# EAGLE design rzlblink_v2a (EAGLE 6.3)
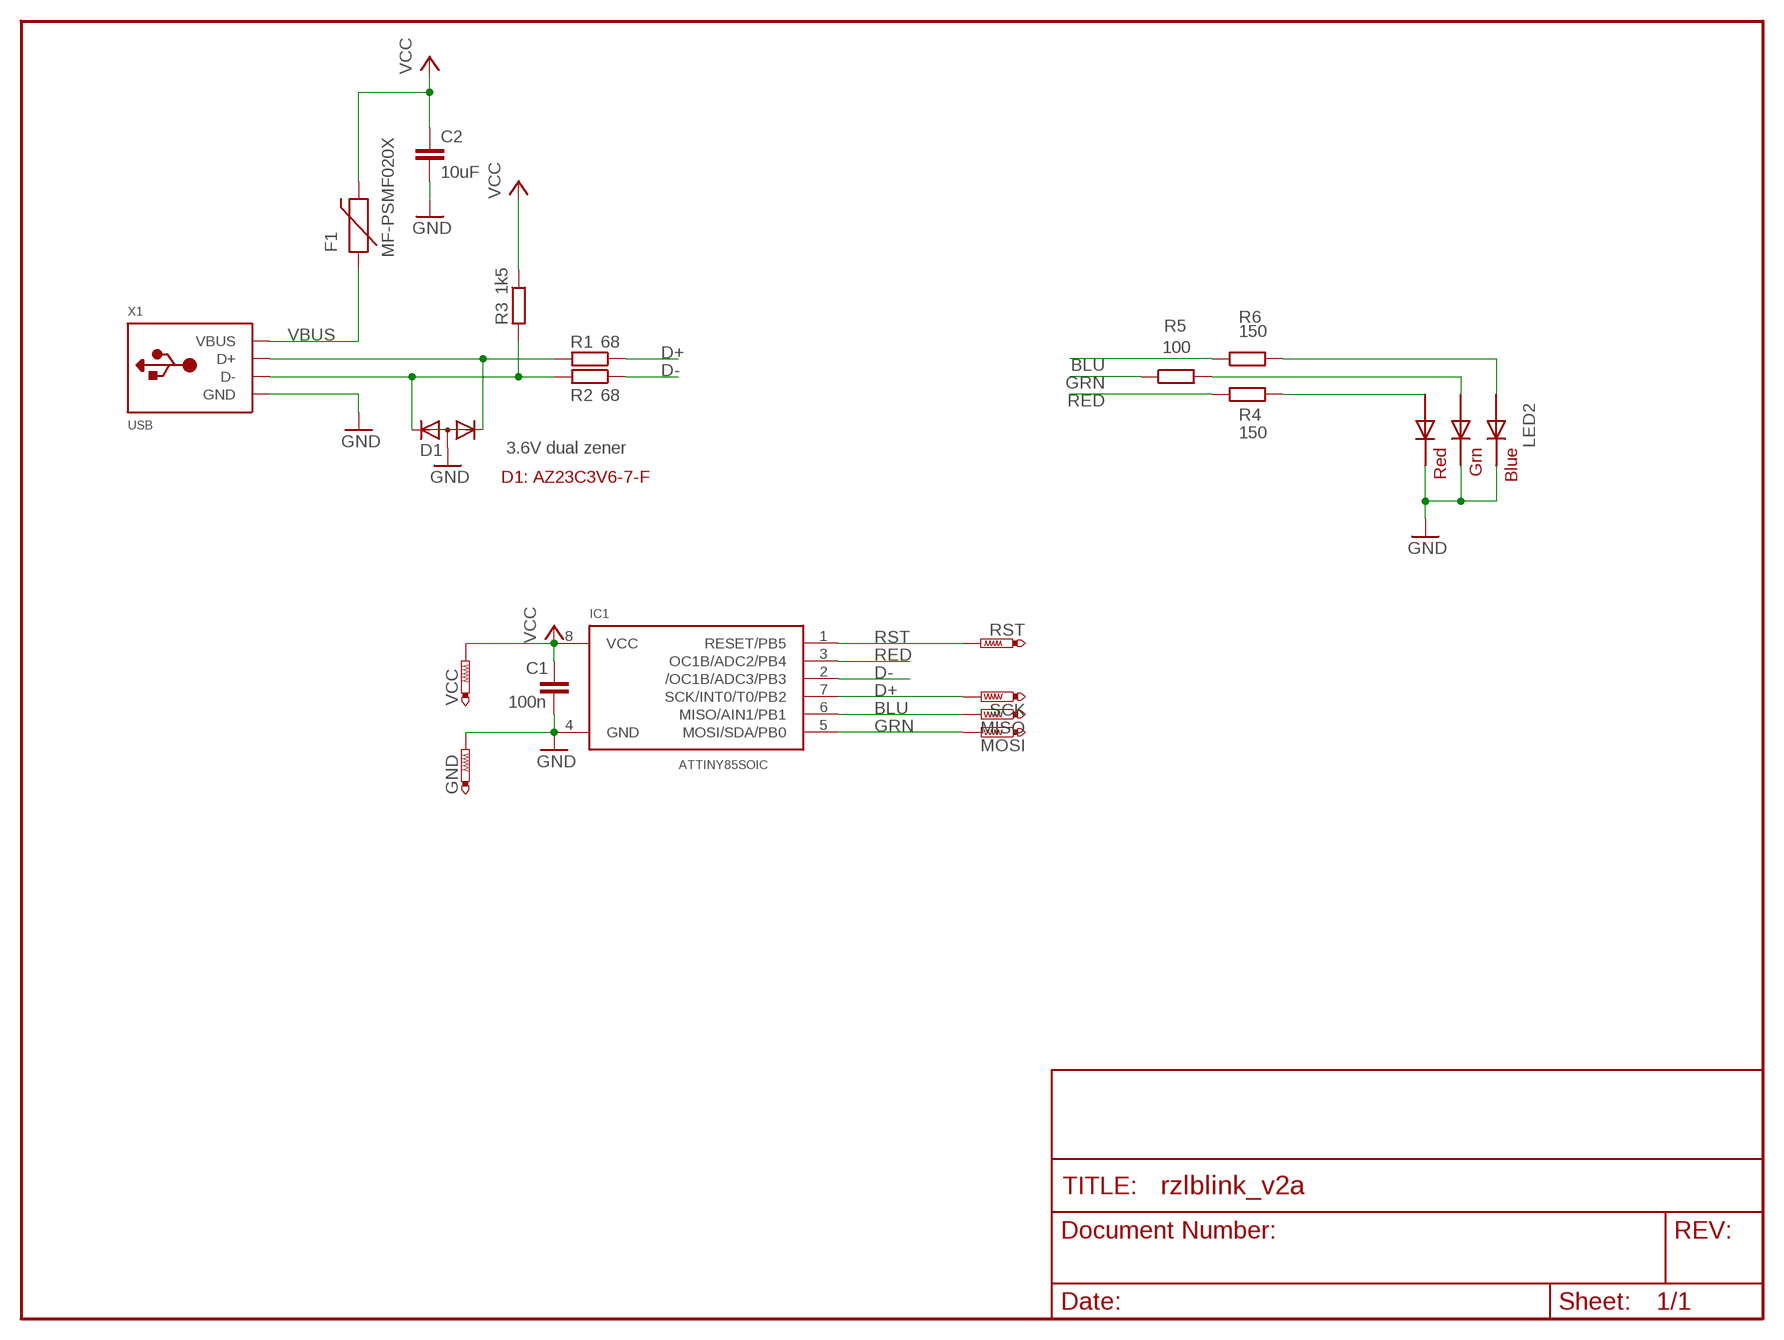
[diagram p0: schematic, sheet 1]

## Parts
C1  100n  C-EUC0805  [C0805]
C2  10uF  C-EUC0805  [C0805]
D1  3.6V dual zener  DIODE-2CA|ACSOT23  [SOT23]
F1  MF-PSMF020X  PTC0805  [0805]
GND  PTR1TP10R  [TP10R]
IC1  ATTINY85SOIC  ATTINY45SOIC  [SO08-EIAJ]
LED2  RGBLED5050  [RGBLED5050]
MISO  PTR1TP10R  [TP10R]
MOSI  PTR1TP10R  [TP10R]
R1  68  R-EU_R1206  [R1206]
R2  68  R-EU_R1206  [R1206]
R3  1k5  R-EU_R0805  [R0805]
R4  150  R-EU_R0805  [R0805]
R5  100  R-EU_R0805  [R0805]
R6  150  R-EU_R0805  [R0805]
RST  PTR1TP10R  [TP10R]
SCK  PTR1TP10R  [TP10R]
VCC  PTR1TP10R  [TP10R]
X1  USB  [MOLEX-48037-1000]

## Nets
BLU: IC1.6(MISO/AIN1/PB1) MISO.TP R6.1
D+: IC1.7(SCK/INT0/T0/PB2) R1.1 SCK.TP
D-: IC1.2(/OC1B/ADC3/PB3) R2.1
GND: C1.2 C2.2 D1.3(A) GND.TP IC1.4(GND) LED2.4(BLUE_C) LED2.5(RED_C) LED2.6(GREEN_C) X1.4(GND)
GRN: IC1.5(MOSI/SDA/PB0) MOSI.TP R5.1
N$4: D1.1(K1) R1.2 X1.3(D+)
N$5: D1.2(K2) R2.2 R3.2 X1.2(D-)
RBLU: LED2.3(BLUE_A) R6.2
RED: IC1.3(OC1B/ADC2/PB4) R4.1
RGRN: LED2.1(GREEN_A) R5.2
RRED: LED2.2(RED_A) R4.2
RST: IC1.1(RESET/PB5) RST.TP
VBUS: F1.1 X1.1(VBUS)
VCC: C1.1 C2.1 F1.2 IC1.8(VCC) R3.1 VCC.TP

## Notes on the sheet
- D1: AZ23C3V6-7-F

## Library data of the parts
C1 C2 = resistor:C-EU: CAPACITOR, European symbol
D1 = diode:DIODE-2CA|AC: Dual DIODE Cathode-Anode|Anode-Cathode
F1 = todstuff:PTC
GND MISO MOSI RST SCK VCC = testpad:PTR1: TEST PIN
IC1 = todstuff:ATTINY45
LED2 = adafruit:RGBLED: For 5050 RGB LEDs, the order of the LEDs may vary from one manufacturer to another!
R1-R6 = resistor:R-EU_: RESISTOR, European symbol
X1 = todstuff:USB

## Board
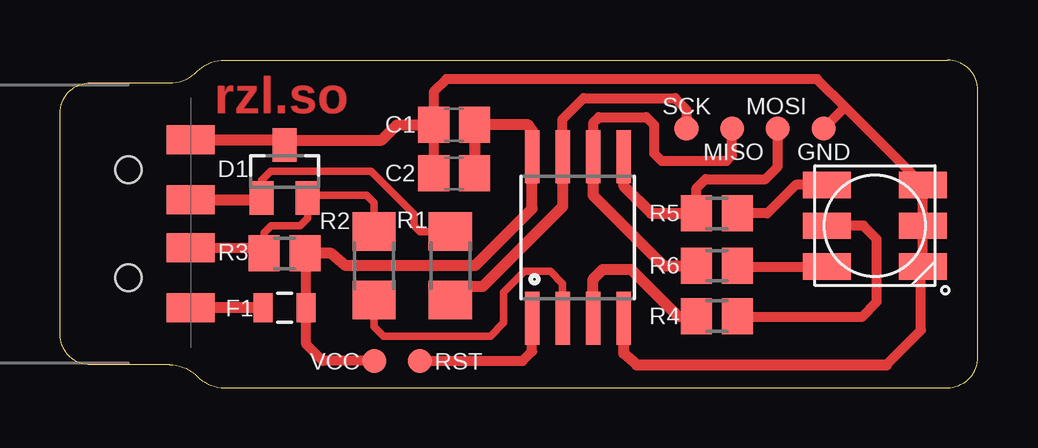
[diagram p1: board, top side]
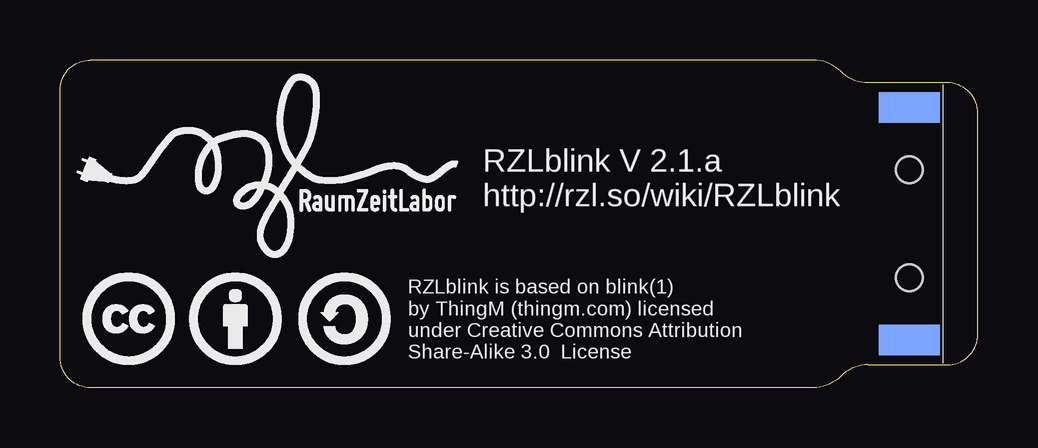
[diagram p2: board, bottom side, seen from below]

Size 38.26 x 13.65 mm. Coordinates in mm from the lower left corner, seen from the top.
Outline: 4.57,0.95 1.27,0.95 arc-90 0,2.22 0,11.43 arc-90 1.27,12.7 3.81,12.7 4.08,12.7 4.57,12.7 arc45 5.71,13.18 arc-45 6.86,13.65 36.99,13.65 arc-90 38.26,12.38 38.26,1.27 arc-90 36.99,0 6.86,0 arc-45 5.71,0.48 arc45 4.57,0.95
Copper layers (1*16): Top 0.035mm / dielectric 1.5mm / Bottom 0.035mm
Design rules "multi-cb_035um-cu *": minimum track width 6mil, minimum drill 12mil, track to track 10mil, track to pad 10mil, pad to pad 10mil, via to via 10mil, smd to smd 10mil, copper to edge 20mil, drill to drill 8mil, minimum pad ring 8mil, minimum via ring 6mil, stop-mask expansion 3mil, vias tented up to drill 0mil, thermal gap 8mil

### Footprints (pad centres in the part's own frame; a part is rotated, then mirrored left to right if it is on the bottom)
C0805 = smd 1.3 x 1.5: 1 -0.85,0; 2 0.85,0
SOT23 = smd 1 x 1.4: 1 -0.95,-1.1; 2 0.95,-1.1; 3 0,1.1
0805 = smd 0.8 x 1.2: 1 -0.9,0; 2 0.9,0
TP10R = smd 1 x 1: TP 0,0
SO08-EIAJ = smd 0.61 x 2.21: 1 -1.905,-3.378; 2 -0.635,-3.378; 3 0.635,-3.378; 4 1.905,-3.378; 5 1.905,3.353; 6 0.635,3.353; 7 -0.635,3.353; 8 -1.905,3.353
RGBLED5050 = smd 2 x 1.1: 1 -2,1.7; 2 -2,0; 3 -2,-1.7; 4 2,-1.7; 5 2,0; 6 2,1.7
R1206 = smd 1.6 x 1.803: 1 -1.422,0; 2 1.422,0
R0805 = smd 1.3 x 1.5: 1 -0.85,0; 2 0.85,0
MOLEX-48037-1000 = smd 2 x 1.2: 1 2.6,-3.5; 2 2.6,-1; 3 2.6,1; 4 2.6,3.5 | smd 2.54 x 1.27 bottom: P$1 0,4.85; P$2 0,-4.85 | hole 1.1: 0,2.25; 0,-2.25

### Placement (x,y rotation side)
C1  16.43,10.95 180 top
C2  16.43,8.93 180 top
D1  9.37,9.01 0 top
F1  9.37,3.33 0 top
GND  31.83,10.8 0 top
IC1  21.59,6.27 0 top
LED2  33.97,6.75 0 top
MISO  28.02,10.8 0 top
MOSI  29.92,10.8 0 top
R1  16.27,5.08 90 top
R2  13.1,5.08 90 top
R3  9.37,5.6 180 top
R4  27.38,2.98 0 top
R5  27.38,7.26 0 top
R6  27.38,5.08 0 top
RST  15,1.11 0 top
SCK  26.11,10.8 0 top
VCC  13.1,1.11 0 top
X1  2.86,6.83 0 top

### Tracks (layer width: path | path; a pad name or v marks a point on that pad's centre or on a via)
BLU
  Top 0.406: IC1.6 22.15,9.7 22.15,10.32 22.22,10.4 22.22,11.03 22.46,11.27 24.45,11.27 24.77,10.95 24.77,9.76 25.08,9.45 27.78,9.45 28.02,9.68 MISO.TP
  Top 0.457: IC1.6 22.22,8.02 25.16,5.08 R6.1
D+
  Top 0.406: IC1.7 20.95,11.19 21.83,12.06 25.64,12.06 26.11,11.59 SCK.TP
  Top 0.457: IC1.7 20.95,7.54 17.62,4.21 16.83,4.21 16.28,3.66 R1.1
D-
  Top 0.305: R2.1 13.1,2.54 13.49,2.14 17.94,2.14 18.49,2.7 18.49,3.97 19.37,4.84 20.44,4.84 20.95,4.33 IC1.2
GND
  Top 0.406: 34.45,0.95 35.89,2.4 35.89,4.97 LED2.4 LED2.5 LED2.6 32.81,11.61 | 32.81,11.61 31.56,12.86 16.11,12.86 15.58,12.33 C1.2 C2.2 | GND.TP 32.65,11.61 32.81,11.61
  Top 0.457: X1.4 9.15,10.33 D1.3 9.58,10.32 13.41,10.32 14.05,10.95 C1.2 | IC1.4 23.49,1.43 24.05,0.95 34.45,0.95
GRN
  Top 0.406: R5.1 26.53,8.32 26.91,8.69 29.41,8.69 29.92,9.21 MOSI.TP
  Top 0.457: IC1.5 23.49,8.41 24.65,7.26 R5.1
N$4
  Top 0.305: D1.1 8.41,8.65 8.77,9.01 12.98,9.01 14.76,7.22 14.76,6.75 15.01,6.5 R1.2
  Top 0.457: X1.3 8.33,7.83 D1.1
N$5
  Top 0.305: 8.29,5.83 arc-90 R3.2 8.52,6.45 8.81,6.75 10,6.75 10.32,7.06 arc-45 10.32,7.07 D1.2 10.32,8.02 12.78,8.02 13.1,7.7 R2.2
  Top 0.406: X1.2 8.52,5.83 R3.2
RBLU
  Top 0.406: 28.27,5.05 LED2.3
  Top 0.457: R6.2 28.27,5.05
RED
  Top 0.457: IC1.3 22.22,4.52 22.62,4.92 23.81,4.92 25.76,2.98 R4.1
RGRN
  Top 0.406: LED2.1 30.67,8.45 29.49,7.26 R5.2
  Top 0.457: R5.2 28.27,7.22
RRED
  Top 0.406: LED2.2 33.5,6.75 34.05,6.19 34.05,3.57 33.42,2.94 28.23,2.94 R4.2
  Top 0.457: R4.2 28.27,2.94
RST
  Top 0.406: RST.TP 19.29,1.11 19.68,1.51 IC1.1
VBUS
  Top 0.457: F1.1 X1.1
VCC
  Top 0.406: R3.1 10.27,5.55 F1.2 10.27,1.8 10.95,1.11 VCC.TP
  Top 0.457: R3.1 11.31,5.6 11.91,5.08 17.3,5.08 19.68,7.46 IC1.8 19.68,10.72 19.53,10.95 C1.1 C2.1

### Text on the board
Top: rzl.so
bPlace: RZLblink V 2.1.a / http://rzl.so/wiki/RZLblink | RZLblink is based on blink(1) / by ThingM (thingm.com) licensed / under Creative Commons Attribution / Share-Alike 3.0 License